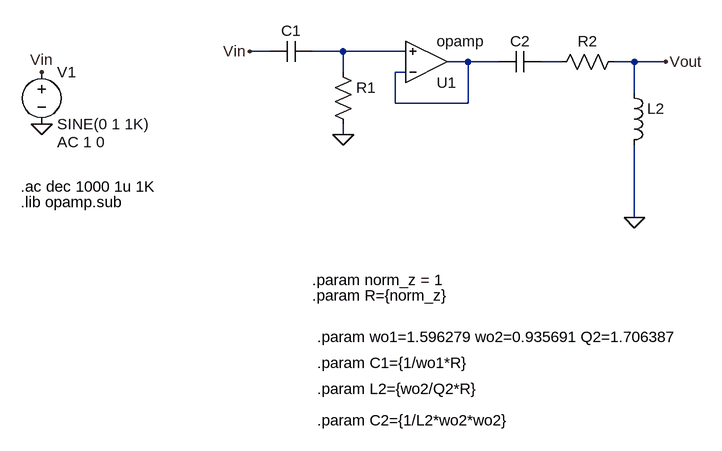
[diagram p0: schematic HPF_sinvalores.asc]
HPF_sinvalores.asc, the LTspice schematic file:
Version 4.1
SHEET 1 880 696
WIRE 80 112 48 112
WIRE 192 112 144 112
WIRE 288 112 192 112
WIRE 384 128 352 128
WIRE 432 128 384 128
WIRE 528 128 496 128
WIRE 640 128 608 128
WIRE 688 128 640 128
WIRE 192 144 192 112
WIRE 288 144 272 144
WIRE 640 176 640 128
WIRE 272 192 272 144
WIRE 384 192 384 128
WIRE 384 192 272 192
WIRE 192 240 192 224
WIRE 640 368 640 256
FLAG 192 240 0
FLAG 48 112 Vin
FLAG 688 128 Vout
FLAG -272 224 0
FLAG -272 144 Vin
FLAG 640 368 0
SYMBOL res 176 128 R0
SYMATTR InstName R1
SYMATTR Value ""
SYMBOL cap 144 96 R90
WINDOW 0 0 32 VBottom 2
WINDOW 3 32 32 VTop 2
SYMATTR InstName C1
SYMATTR Value ""
SYMBOL OpAmps\\opamp 320 192 M180
SYMATTR InstName U1
SYMBOL cap 496 112 R90
WINDOW 0 0 32 VBottom 2
WINDOW 3 32 32 VTop 2
SYMATTR InstName C2
SYMATTR Value ""
SYMBOL res 624 112 R90
WINDOW 0 0 56 VBottom 2
WINDOW 3 32 56 VTop 2
SYMATTR InstName R2
SYMATTR Value ""
SYMBOL ind 624 160 R0
SYMATTR InstName L2
SYMATTR Value ""
SYMATTR SpiceLine Rser=1m
SYMBOL voltage -272 128 R0
WINDOW 123 24 124 Left 2
WINDOW 39 0 0 Left 0
SYMATTR Value2 AC 1 0
SYMATTR InstName V1
SYMATTR Value SINE(0 1 1K)
TEXT -304 320 Left 2 !.ac dec 1000 1u 1K
TEXT -304 344 Left 2 !.lib opamp.sub
TEXT 144 464 Left 2 !.param norm_z = 1
TEXT 144 488 Left 2 !.param R={norm_z}
TEXT 152 552 Left 2 !.param wo1=1.596279 wo2=0.935691 Q2=1.706387
TEXT 152 592 Left 2 !.param C1={1/wo1*R}
TEXT 152 632 Left 2 !.param L2={wo2/Q2*R}
TEXT 152 680 Left 2 !.param C2={1/L2*wo2*wo2}

The netlist it stands for:
* HPF_sinvalores.asc
R1 N001 0
C1 N001 Vin
X§U1 N002 N001 N002 opamp Aol=100K GBW=10Meg  ; pins invin noninvin out
C2 N003 N002
R2 Vout N003
L2 Vout 0 Rser=1m
V1 Vin 0 SINE(0 1 1K) AC 1 0
.ac dec 1000 1u 1K
.lib opamp.sub
.param norm_z = 1
.param R={norm_z}
.param wo1=1.596279 wo2=0.935691 Q2=1.706387
.param C1={1/wo1*R}
.param L2={wo2/Q2*R}
.param C2={1/L2*wo2*wo2}
.backanno
.end